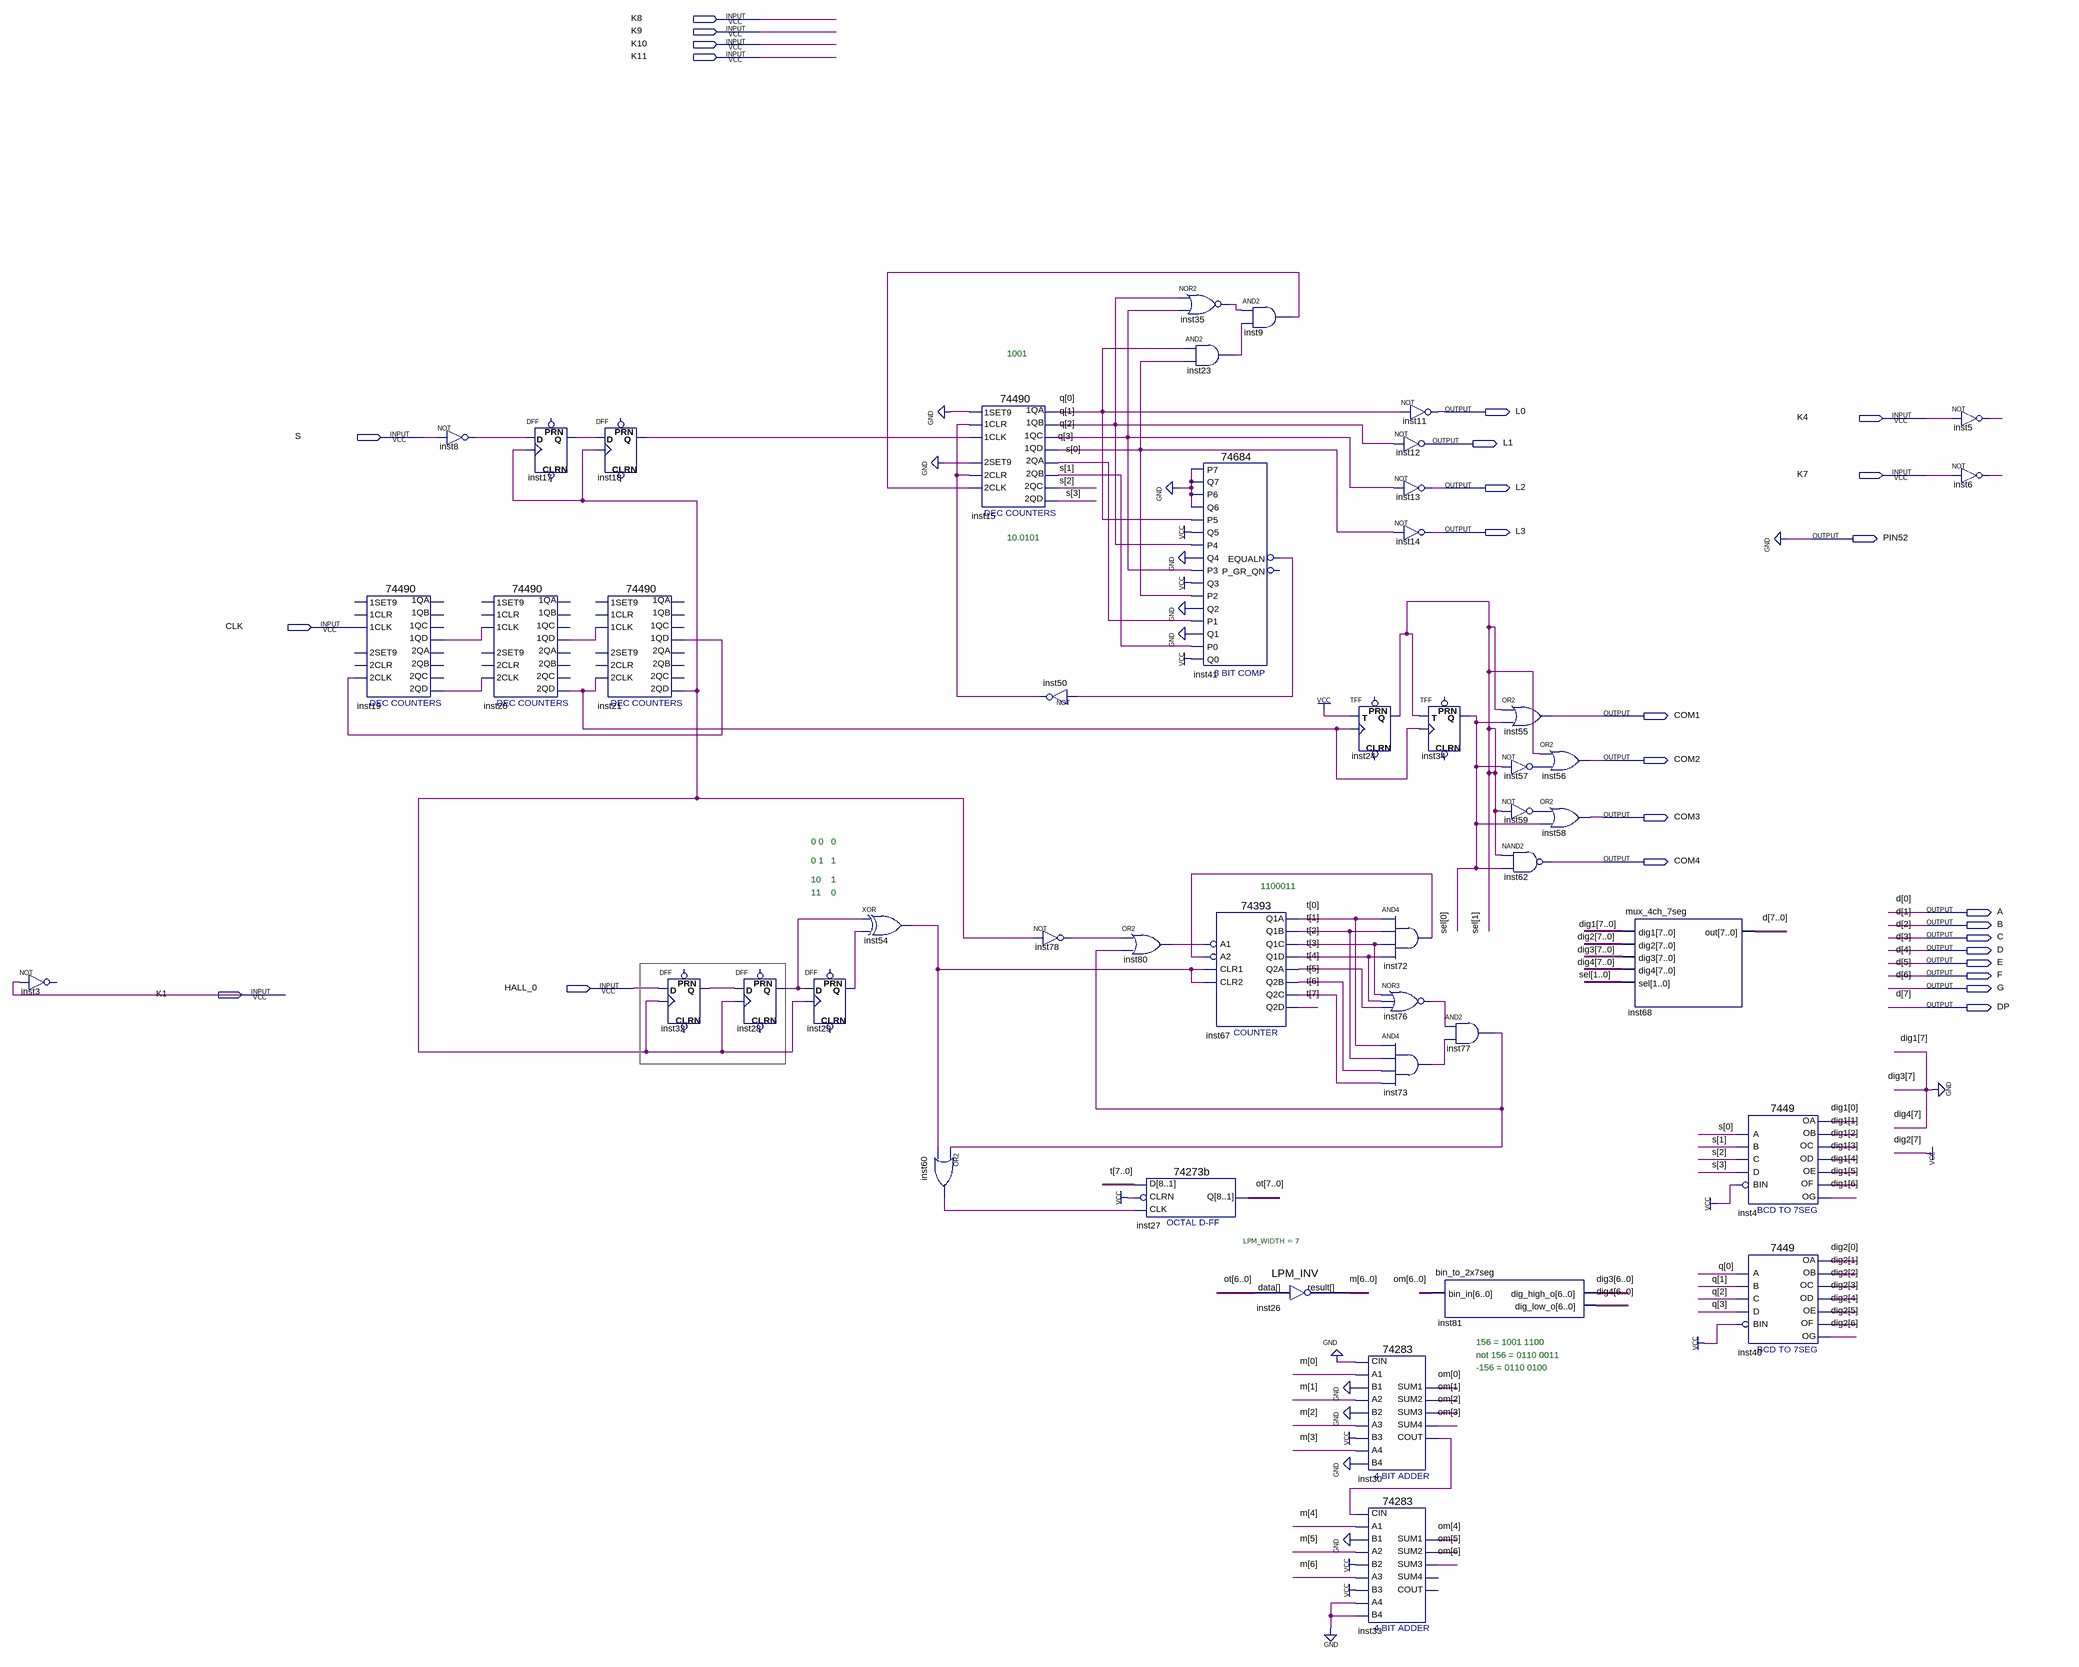
[diagram p0: schematic sheet]
// Quartus schematic HY208.bdf as structural Verilog: 47 symbols, 27 pins
module HY208 (
  input  K8,
  input  K9,
  input  K10,
  input  K11,
  input  K4,
  input  S,
  input  K7,
  input  CLK,
  input  HALL_0,
  input  K1,
  output L0,
  output L1,
  output L2,
  output L3,
  output PIN52,
  output COM1,
  output COM2,
  output COM3,
  output COM4,
  output A,
  output B,
  output C,
  output D,
  output E,
  output F,
  output G,
  output DP
);

  wire inst5_out, inst6_out, inst8_out, inst9_out, inst17_q, inst18_q, inst19_1qd, inst19_2qd, inst20_1qd,
       inst20_2qd, inst21_1qd, inst21_2qd, inst23_out, inst28_q, inst29_q, inst30_cout, inst32_q, inst35_out,
       inst41_equaln, inst50_out, inst54_out, inst57_out, inst59_out, inst60_out, inst72_out, inst73_out,
       inst76_out, inst77_out, inst78_out, inst80_out;
  wire [1:0] sel;
  wire [3:0] q, S_bus;
  wire [6:0] dig1, dig2, dig3, dig4, m, om;
  wire [7:0] ot, t;

  // NOT inst3 has open pins: IN=K1, OUT=open
  \74490  inst19 (
    .\1CLK (CLK), .\2CLK (inst21_1qd), .\1QD (inst19_1qd), .\2QD (inst19_2qd));  // open: 2SET9, 1SET9, 1CLR, 2CLR, 1QB, 1QA, 1QC, 2QA, 2QC, 2QB
  not inst8 (inst8_out, S);
  \74490  inst20 (
    .\1CLK (inst19_1qd), .\2CLK (inst19_2qd), .\1QD (inst20_1qd), .\2QD (inst20_2qd));  // open: 2SET9, 1SET9, 1CLR, 2CLR, 1QB, 1QA, 1QC, 2QA, 2QC, 2QB
  DFF inst17 (.CLK(inst21_2qd), .D(inst8_out), .Q(inst17_q));  // open: CLRN, PRN
  DFF inst18 (.CLK(inst21_2qd), .D(inst17_q), .Q(inst18_q));  // open: CLRN, PRN
  \74490  inst21 (
    .\1CLK (inst20_1qd), .\2CLK (inst20_2qd), .\1QD (inst21_1qd), .\2QD (inst21_2qd));  // open: 2SET9, 1SET9, 1CLR, 2CLR, 1QB, 1QA, 1QC, 2QA, 2QC, 2QB
  DFF inst32 (.CLK(inst21_2qd), .D(HALL_0), .Q(inst32_q));  // open: CLRN, PRN
  DFF inst28 (.CLK(inst21_2qd), .D(inst32_q), .Q(inst28_q));  // open: CLRN, PRN
  DFF inst29 (.CLK(inst21_2qd), .D(inst28_q), .Q(inst29_q));  // open: CLRN, PRN
  xor inst54 (inst54_out, inst28_q, inst29_q);
  or inst60 (inst60_out, inst77_out, inst54_out);
  \74490  inst15 (
    .\2SET9 (1'b0), .\1SET9 (1'b0), .\1CLK (inst18_q), .\2CLK (inst9_out), .\1CLR (inst50_out),
    .\2CLR (inst50_out), .\1QB (q[1]), .\1QA (q[0]), .\1QC (q[2]), .\1QD (q[3]), .\2QA (S_bus[0]),
    .\2QC (S_bus[2]), .\2QB (S_bus[1]), .\2QD (S_bus[3]));
  not inst50 (inst50_out, inst41_equaln);
  not inst78 (inst78_out, inst21_2qd);
  or inst80 (inst80_out, inst78_out, inst77_out);
  nor inst35 (inst35_out, q[1], q[2]);
  \74273b  inst27 (.CLK(inst60_out), .D(t), .CLRN(1'b1), .Q(ot));
  and inst23 (inst23_out, q[0], q[3]);
  \74684  inst41 (
    .P2(q[3]), .Q2(1'b0), .P1(S_bus[0]), .Q1(1'b0), .P0(S_bus[1]), .Q0(1'b1), .P7(1'b0), .Q7(1'b0),
    .Q6(1'b0), .P6(1'b0), .Q5(1'b1), .P5(q[0]), .P4(q[1]), .Q4(1'b0), .Q3(1'b1), .P3(q[2]),
    .EQUALN(inst41_equaln));  // open: P_GR_QN
  \74393  inst67 (
    .A1(inst80_out), .CLR1(inst54_out), .A2(inst72_out), .CLR2(inst54_out), .Q2D(t[7]), .Q2C(t[6]),
    .Q2B(t[5]), .Q1C(t[2]), .Q1D(t[3]), .Q2A(t[4]), .Q1A(t[0]), .Q1B(t[1]));
  and inst9 (inst9_out, inst35_out, inst23_out);
  LPM_INV #(.LPM_WIDTH(7)) inst26 (.data(ot[6:0]), .result(m));
  TFF inst24 (.T(1'b1), .CLK(inst20_2qd), .Q(sel[1]));  // open: PRN, CLRN
  and inst72 (inst72_out, t[0], t[1], t[2], t[3]);
  nor inst76 (inst76_out, t[2], t[3], t[4]);
  and inst73 (inst73_out, t[0], t[1], t[5], t[6]);
  \74283  inst30 (
    .CIN(1'b0), .A1(m[0]), .A2(m[1]), .B2(1'b0), .A3(m[2]), .A4(m[3]), .B4(1'b0), .B1(1'b0), .B3(1'b1),
    .SUM4(om[3]), .COUT(inst30_cout), .SUM1(om[0]), .SUM2(om[1]), .SUM3(om[2]));
  \74283  inst33 (
    .CIN(inst30_cout), .A1(m[4]), .A2(m[5]), .B2(1'b1), .A3(m[6]), .A4(1'b0), .B4(1'b0), .B1(1'b0),
    .B3(1'b1), .SUM1(om[4]), .SUM2(om[5]), .SUM3(om[6]));  // open: SUM4, COUT
  not inst11 (L0, q[0]);
  not inst12 (L1, q[1]);
  not inst13 (L2, q[2]);
  not inst14 (L3, q[3]);
  TFF inst34 (.T(sel[1]), .CLK(inst20_2qd), .Q(sel[0]));  // open: PRN, CLRN
  bin_to_2x7seg inst81 (.bin_in(om), .dig_high_o(dig3), .dig_low_o(dig4));
  and inst77 (inst77_out, inst76_out, inst73_out);
  or inst55 (COM1, sel[1], sel[0]);
  not inst57 (inst57_out, sel[0]);
  not inst59 (inst59_out, sel[1]);
  nand inst62 (COM4, sel[1], sel[0]);
  or inst56 (COM2, sel[1], inst57_out);
  or inst58 (COM3, inst59_out, sel[0]);
  mux_4ch_7seg inst68 (
    .dig1({1'b0, dig1}), .dig2({1'b1, dig2}), .dig3({1'b0, dig3}), .dig4({1'b0, dig4}), .sel(sel),
    .out({DP, G, F, E, D, C, B, A}));
  \7449  inst4 (
    .A(S_bus[0]), .C(S_bus[2]), .B(S_bus[1]), .D(S_bus[3]), .BIN(1'b1), .OC(dig1[2]), .OD(dig1[3]),
    .OF(dig1[5]), .OG(dig1[6]), .OB(dig1[1]), .OA(dig1[0]), .OE(dig1[4]));
  \7449  inst40 (
    .A(q[0]), .C(q[2]), .B(q[1]), .D(q[3]), .BIN(1'b1), .OC(dig2[2]), .OD(dig2[3]), .OF(dig2[5]),
    .OG(dig2[6]), .OB(dig2[1]), .OA(dig2[0]), .OE(dig2[4]));
  not inst5 (inst5_out, K4);
  not inst6 (inst6_out, K7);

  assign PIN52 = 1'b0;

  // Other names for the same wires on the sheet: D[7:0] = {DP, G, F, E, D, C, B, A}

  // Notes on the sheet:
  //   1001
  //   10.0101
  //   0 0   0
  //   0 1   1
  //   10    1
  //   1100011
  //   11    0
  //   156 = 1001 1100
  //   not 156 = 0110 0011
  //   -156 = 0110 0100
endmodule
